# EAGLE design UMN_HASP_2015_Front_End_Board1 (EAGLE 6.5.0)

## Sheet 1 of 5: Channel 1
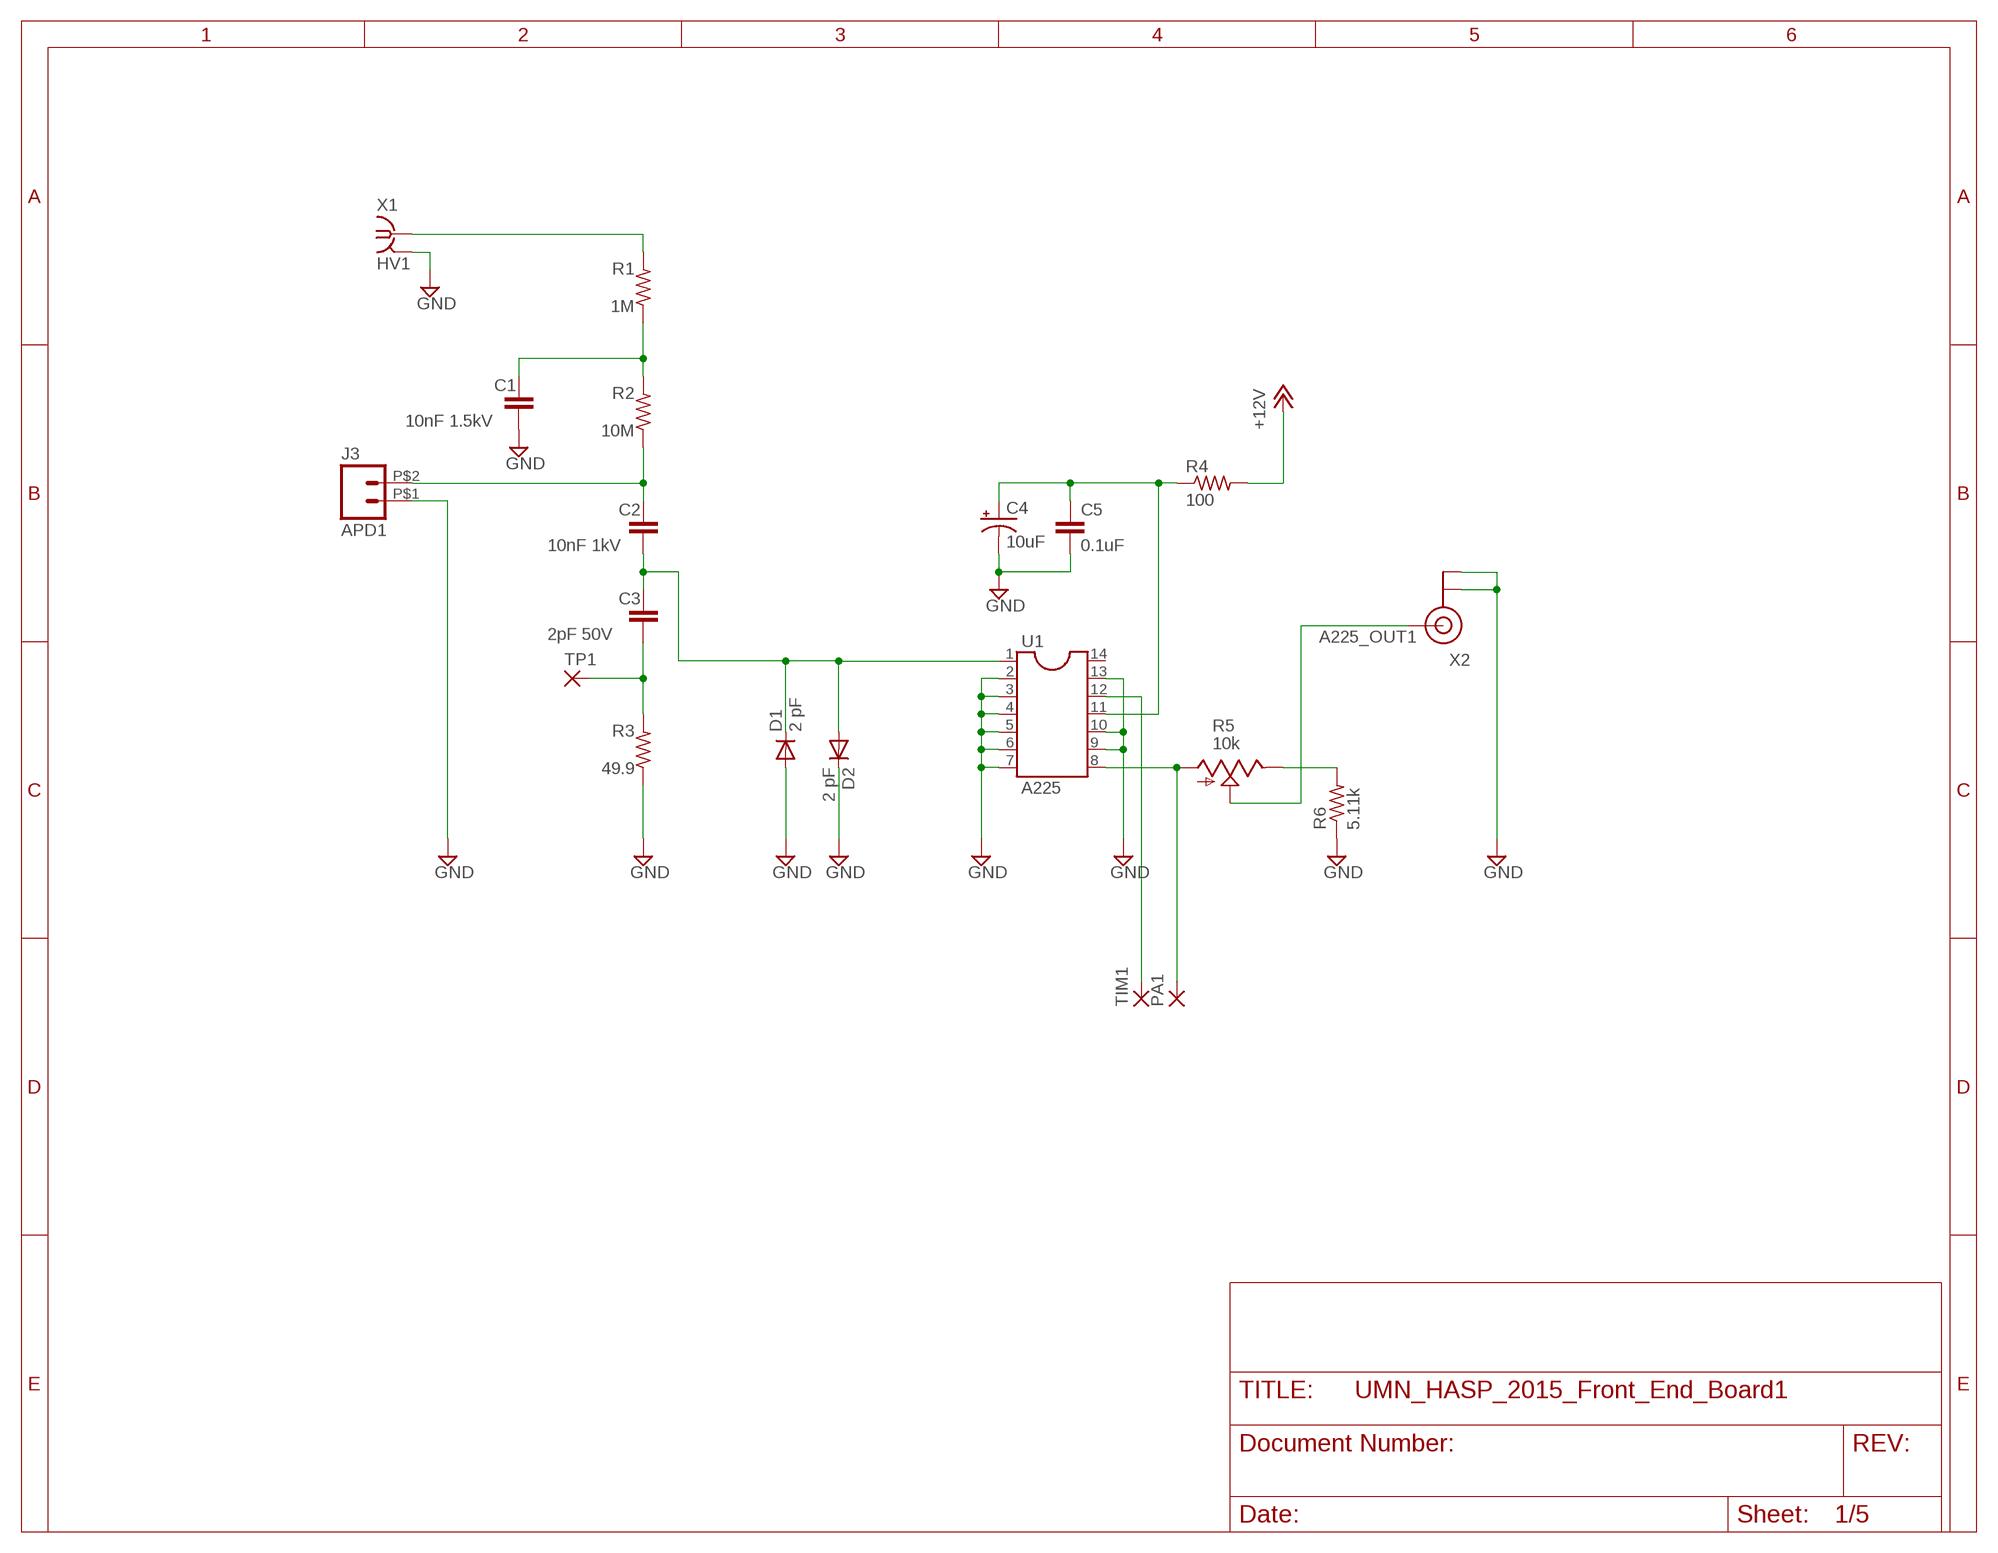
[diagram p0: schematic, sheet 1]

### Parts
C1  10nF 1.5kV  C-EUC1206K  [C1206K]
C2  10nF 1kV  C-EU050-050X075  [C050-050X075]
C3  2pF 50V  C-EUC0402  [C0402]
C4  10uF  CPOL-USC/6032-28R  [C/6032-28R]
C5  0.1uF  C-EUC0603K  [C0603K]
D1  2 pF  DIODE-SOD323-R  [SOD323-R]
D2  2 pF  DIODE-SOD323-R  [SOD323-R]
J3  M02PTH2  [1X02_BIG]
PA1  WIREPADSMD1,27-254  [SMD1,27-2,54]
R1  1M  R-US_R1206  [R1206]
R2  10M  R-US_R1206  [R1206]
R3  49.9  R-US_R0603  [R0603]
R4  100  R-US_R0603  [R0603]
R5  10k  TRIM_US-3223J  [3223J]
R6  5.11k  R-US_R0603  [R0603]
TIM1  WIREPADSMD1,27-254  [SMD1,27-2,54]
TP1  WIREPADSMD1,27-254  [SMD1,27-2,54]
U1  A225  DIL14S  [SOCKET-14]
X1  HV1  BU-SMA-V  [BU-SMA-V]
X2  U.FL  [U.FL]

### Nets
+12V: R4.2 ; also sheet 2,3,4,5
A225_OUT1: R5.2(S) X2.P$3(SIGNAL)
APD1: C2.1 J3.P$2 R2.1
GND: C1.2 C4.- C5.2 D1.A D2.C J3.P$1 R3.1 R6.1 U1.2 U1.3 U1.4 U1.5 U1.6 U1.7 U1.9 U1.10 U1.13 X1.2(GND) X2.P$1(GND) X2.P$2(GND) ; also sheet 2,3,4,5
HV1: R1.2 X1.1
N$1: C1.1 R1.1 R2.2
N$5: C2.2 C3.1 D1.C D2.A U1.1
N$6: R5.3(E) R6.2
N$7: C4.+ C5.1 R4.1 U1.11
PREAMPOUT1: PA1.1(P) R5.1(A) U1.8
TIMING1: TIM1.1(P) U1.12
TP1: C3.2 R3.2 TP1.1(P)
Unconnected: U1.14

## Sheet 2 of 5: Channel 2
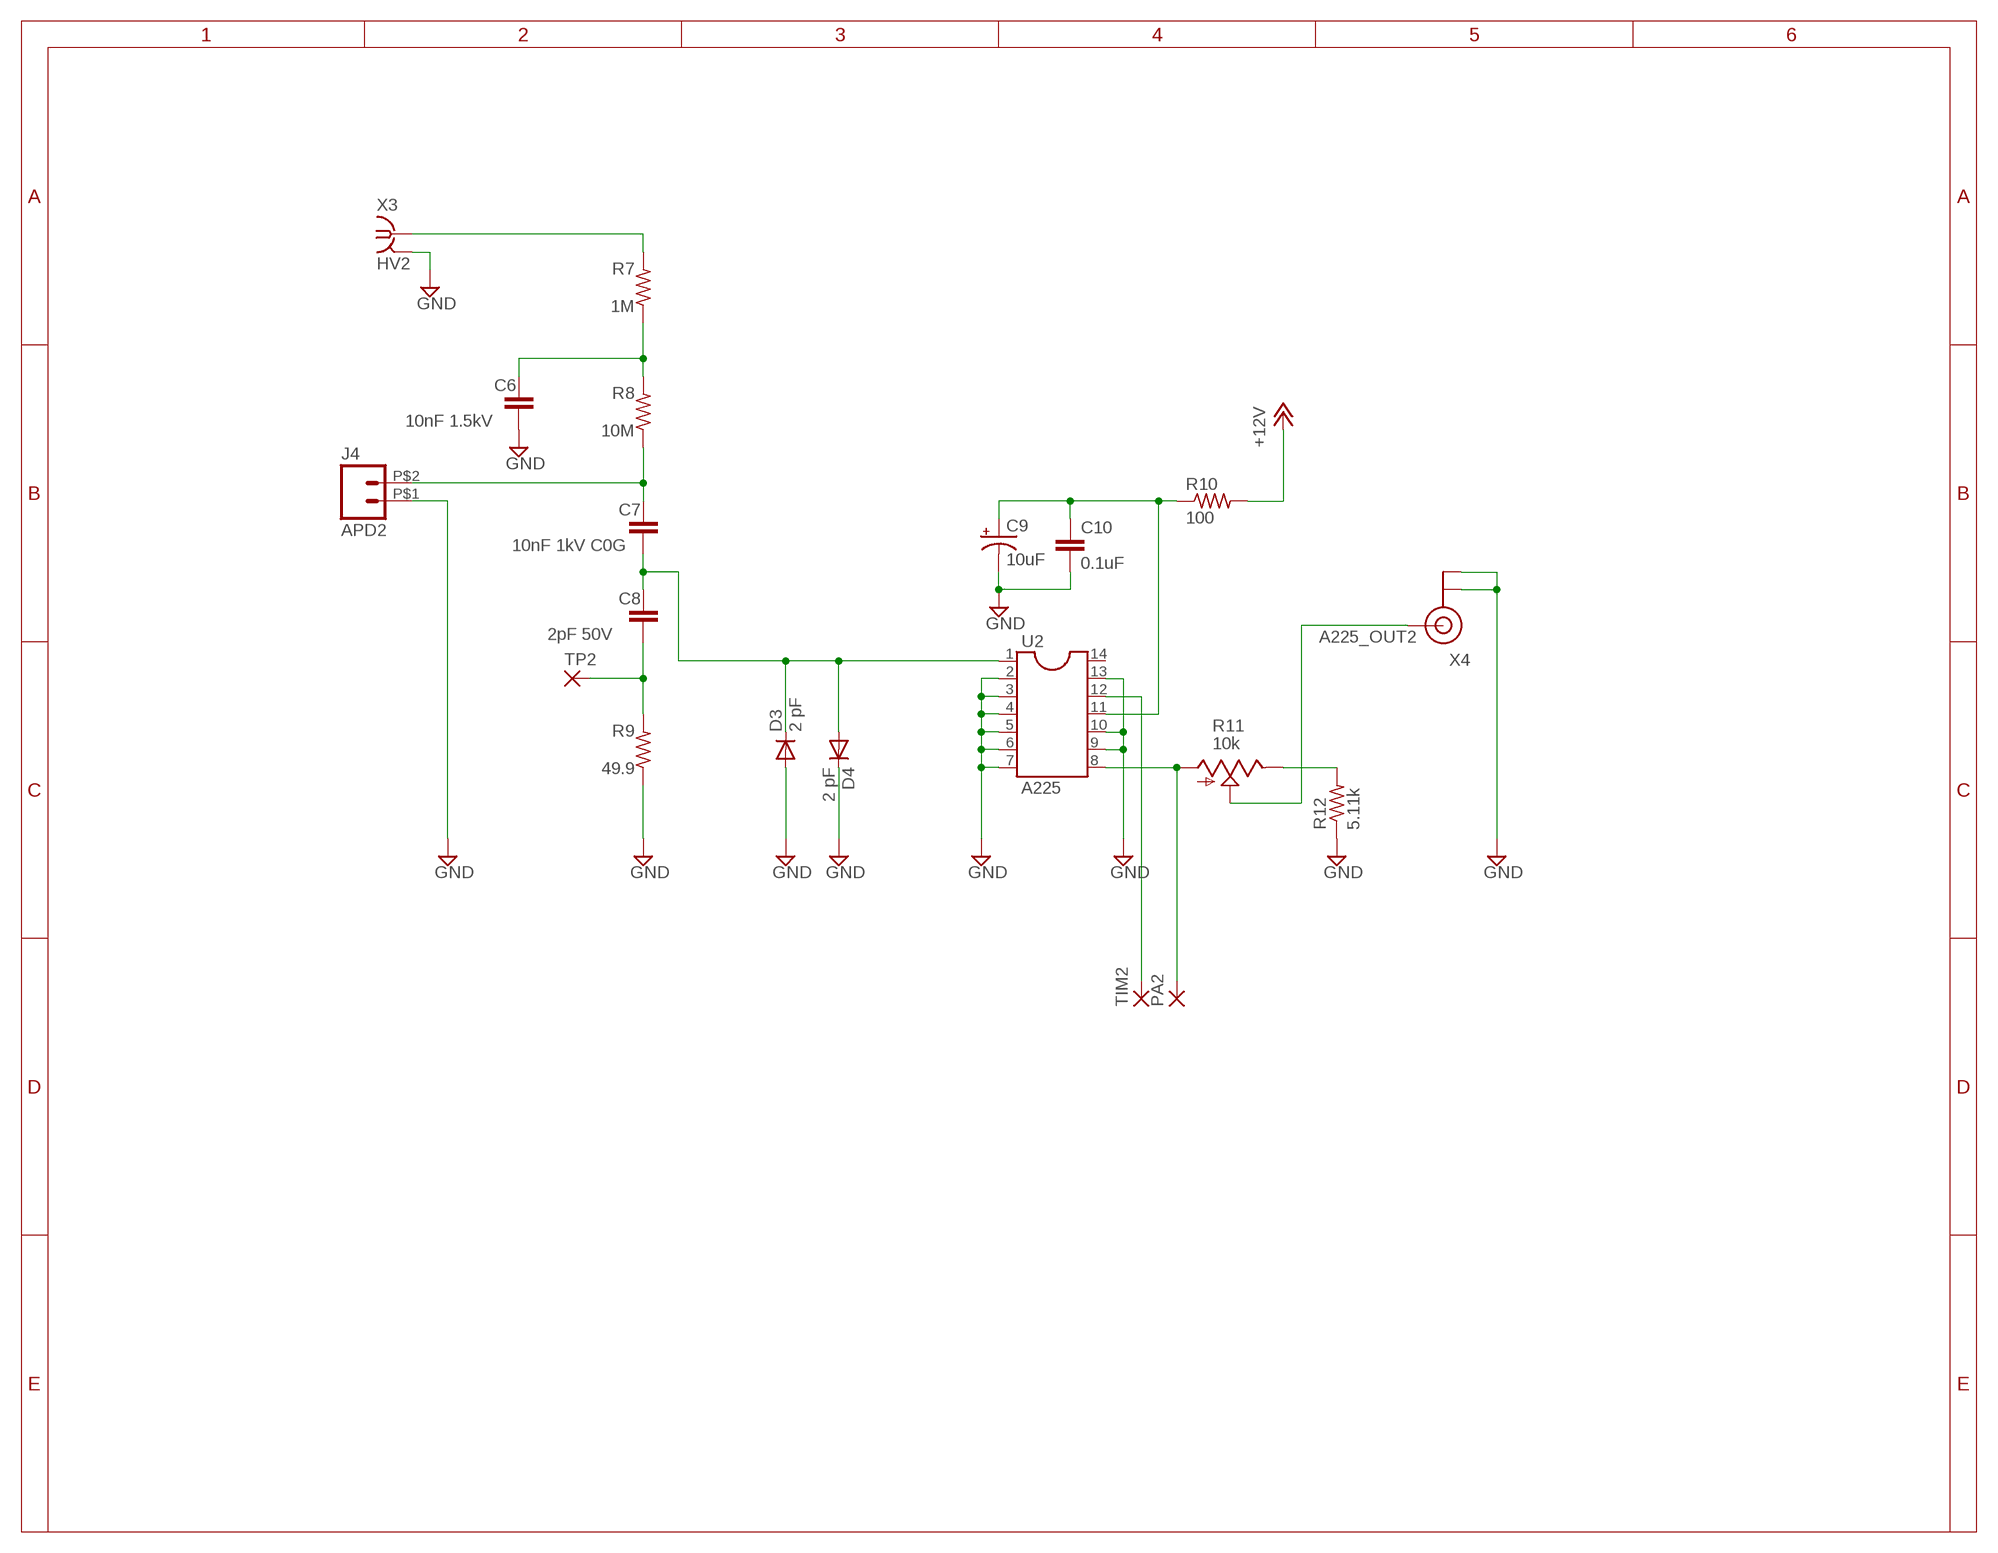
[diagram p1: schematic, sheet 2]

### Parts
C6  10nF 1.5kV  C-EUC1206K  [C1206K]
C7  10nF 1kV C0G  C-EU050-050X075  [C050-050X075]
C8  2pF 50V  C-EUC0402  [C0402]
C9  10uF  CPOL-USC/6032-28R  [C/6032-28R]
C10  0.1uF  C-EUC0603K  [C0603K]
D3  2 pF  DIODE-SOD323-R  [SOD323-R]
D4  2 pF  DIODE-SOD323-R  [SOD323-R]
J4  M02PTH2  [1X02_BIG]
PA2  WIREPADSMD1,27-254  [SMD1,27-2,54]
R7  1M  R-US_R1206  [R1206]
R8  10M  R-US_R1206  [R1206]
R9  49.9  R-US_R0603  [R0603]
R10  100  R-US_R0603  [R0603]
R11  10k  TRIM_US-3223J  [3223J]
R12  5.11k  R-US_R0603  [R0603]
TIM2  WIREPADSMD1,27-254  [SMD1,27-2,54]
TP2  WIREPADSMD1,27-254  [SMD1,27-2,54]
U2  A225  DIL14S  [SOCKET-14]
X3  HV2  BU-SMA-V  [BU-SMA-V]
X4  U.FL  [U.FL]

### Nets
+12V: R10.2 ; also sheet 1,3,4,5
A225_OUT2: R11.2(S) X4.P$3(SIGNAL)
APD2: C7.1 J4.P$2 R8.1
GND: C6.2 C9.- C10.2 D3.A D4.C J4.P$1 R9.1 R12.1 U2.2 U2.3 U2.4 U2.5 U2.6 U2.7 U2.9 U2.10 U2.13 X3.2(GND) X4.P$1(GND) X4.P$2(GND) ; also sheet 1,3,4,5
HV2: R7.2 X3.1
N$11: C9.+ C10.1 R10.1 U2.11
N$15: C6.1 R7.1 R8.2
N$17: C7.2 C8.1 D3.C D4.A U2.1
N$20: R11.3(E) R12.2
PREAMPOUT2: PA2.1(P) R11.1(A) U2.8
TIMING2: TIM2.1(P) U2.12
TP2: C8.2 R9.2 TP2.1(P)
Unconnected: U2.14

## Sheet 3 of 5: Channel 3
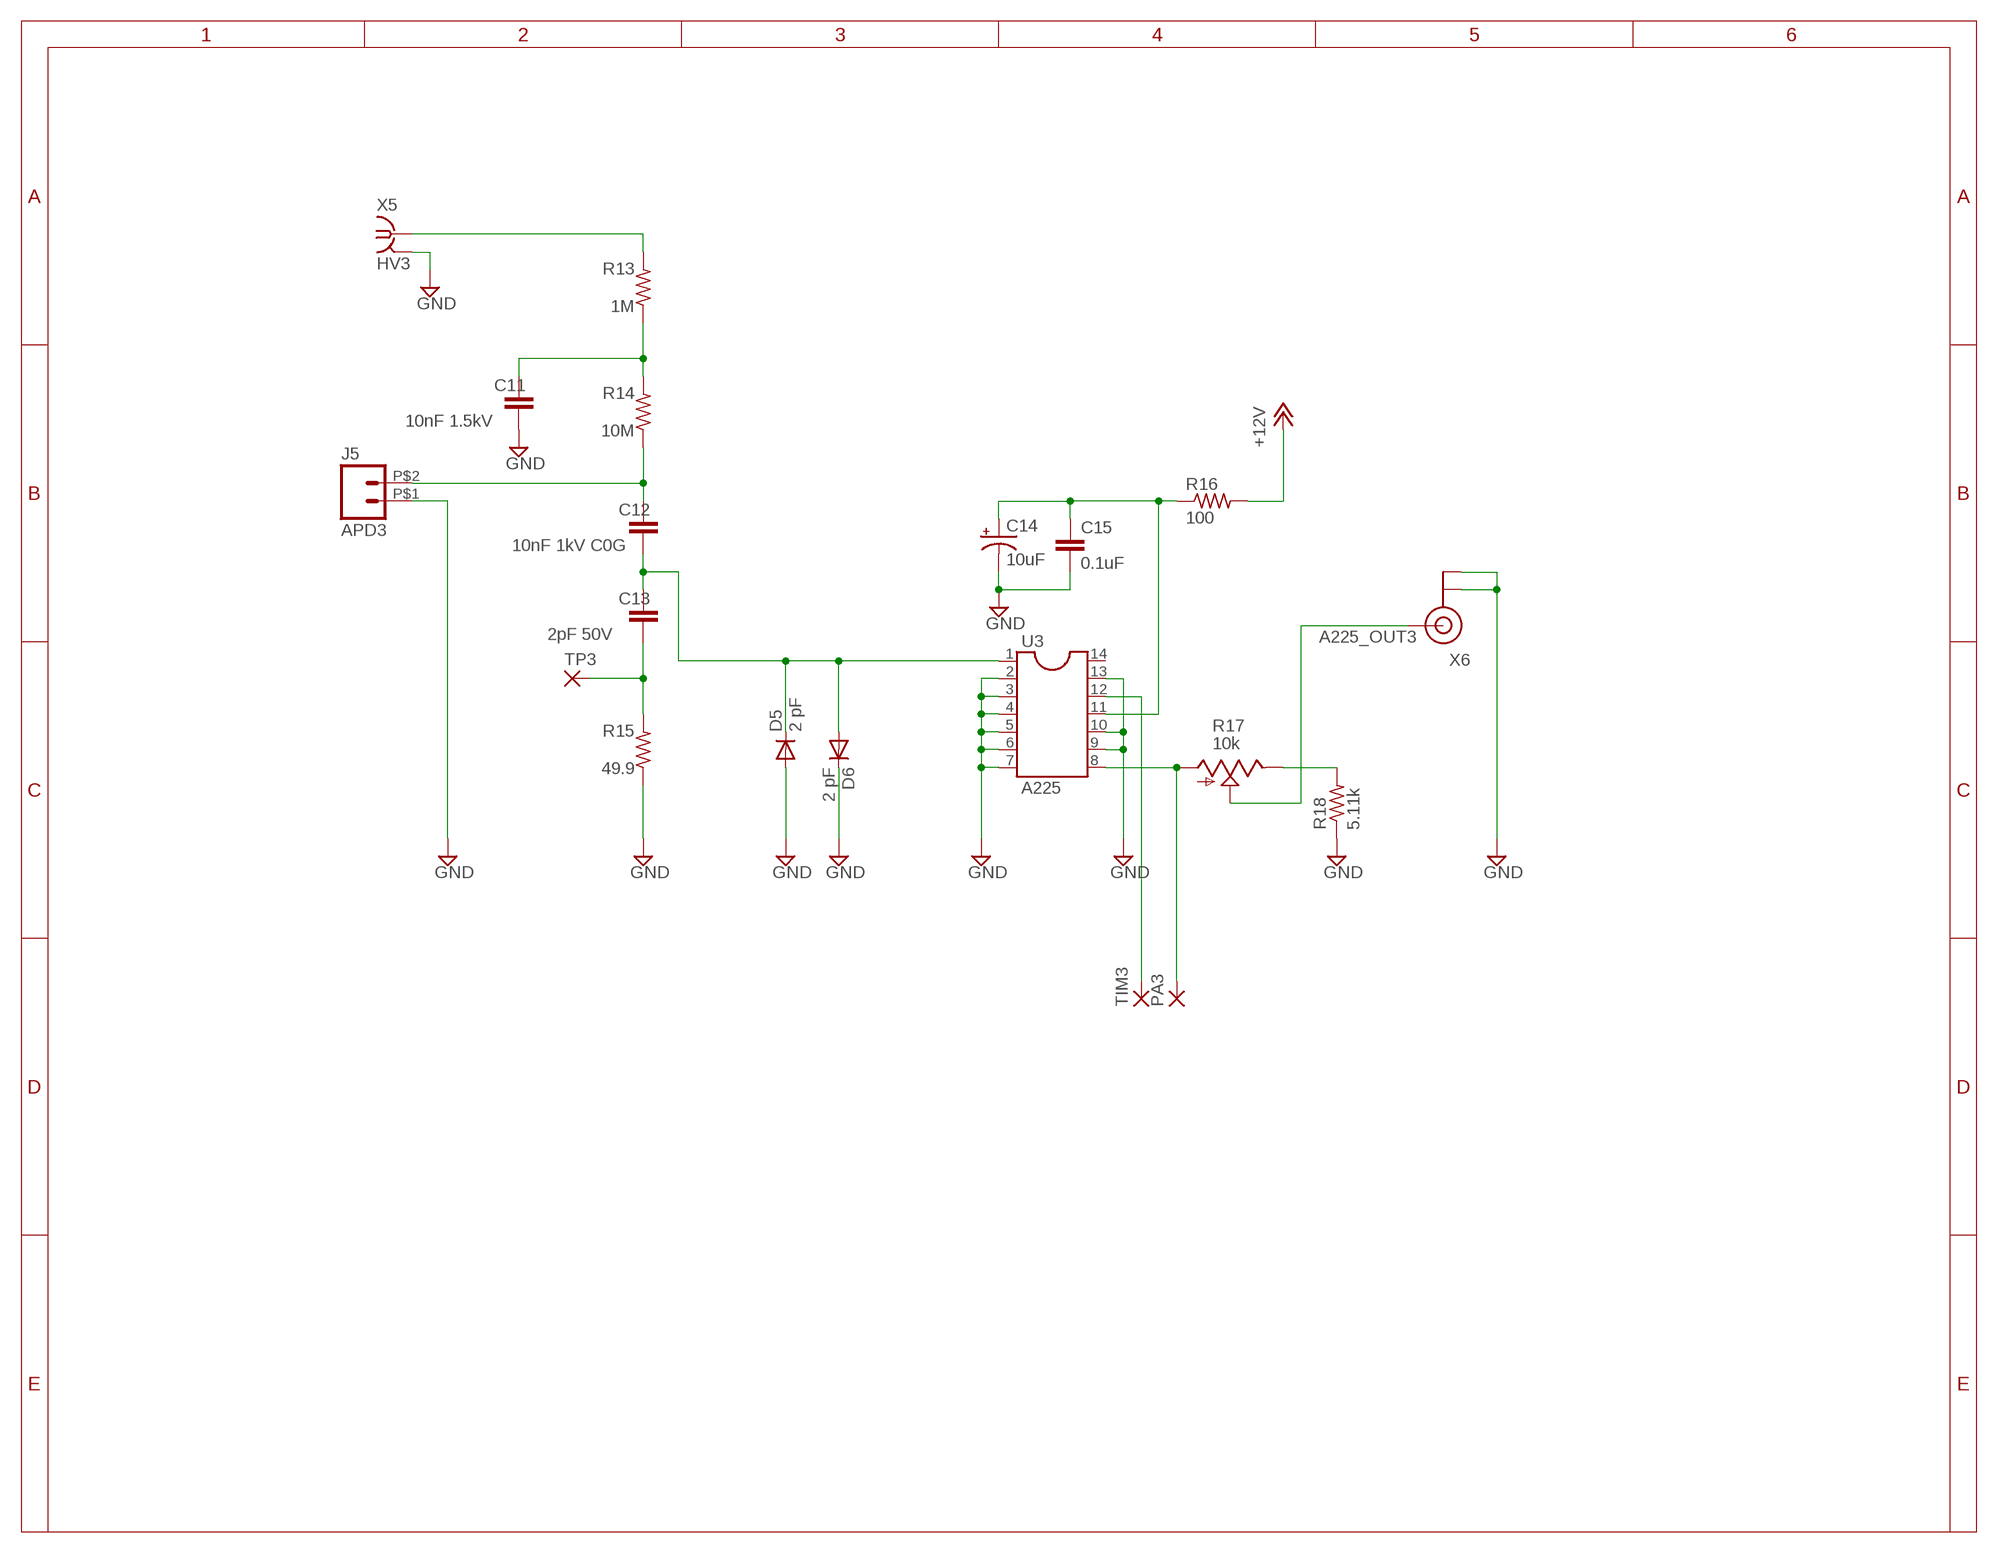
[diagram p2: schematic, sheet 3]

### Parts
C11  10nF 1.5kV  C-EUC1206K  [C1206K]
C12  10nF 1kV C0G  C-EU050-050X075  [C050-050X075]
C13  2pF 50V  C-EUC0402  [C0402]
C14  10uF  CPOL-USC/6032-28R  [C/6032-28R]
C15  0.1uF  C-EUC0603K  [C0603K]
D5  2 pF  DIODE-SOD323-R  [SOD323-R]
D6  2 pF  DIODE-SOD323-R  [SOD323-R]
J5  M02PTH2  [1X02_BIG]
PA3  WIREPADSMD1,27-254  [SMD1,27-2,54]
R13  1M  R-US_R1206  [R1206]
R14  10M  R-US_R1206  [R1206]
R15  49.9  R-US_R0603  [R0603]
R16  100  R-US_R0603  [R0603]
R17  10k  TRIM_US-3223J  [3223J]
R18  5.11k  R-US_R0603  [R0603]
TIM3  WIREPADSMD1,27-254  [SMD1,27-2,54]
TP3  WIREPADSMD1,27-254  [SMD1,27-2,54]
U3  A225  DIL14S  [SOCKET-14]
X5  HV3  BU-SMA-V  [BU-SMA-V]
X6  U.FL  [U.FL]

### Nets
+12V: R16.2 ; also sheet 1,2,4,5
A225_OUT3: R17.2(S) X6.P$3(SIGNAL)
APD3: C12.1 J5.P$2 R14.1
GND: C11.2 C14.- C15.2 D5.A D6.C J5.P$1 R15.1 R18.1 U3.2 U3.3 U3.4 U3.5 U3.6 U3.7 U3.9 U3.10 U3.13 X5.2(GND) X6.P$1(GND) X6.P$2(GND) ; also sheet 1,2,4,5
HV3: R13.2 X5.1
N$2: C11.1 R13.1 R14.2
N$3: C12.2 C13.1 D5.C D6.A U3.1
N$4: R17.3(E) R18.2
N$9: C14.+ C15.1 R16.1 U3.11
PREAMPOUT3: PA3.1(P) R17.1(A) U3.8
TIMING3: TIM3.1(P) U3.12
TP3: C13.2 R15.2 TP3.1(P)
Unconnected: U3.14

## Sheet 4 of 5: Channel 4
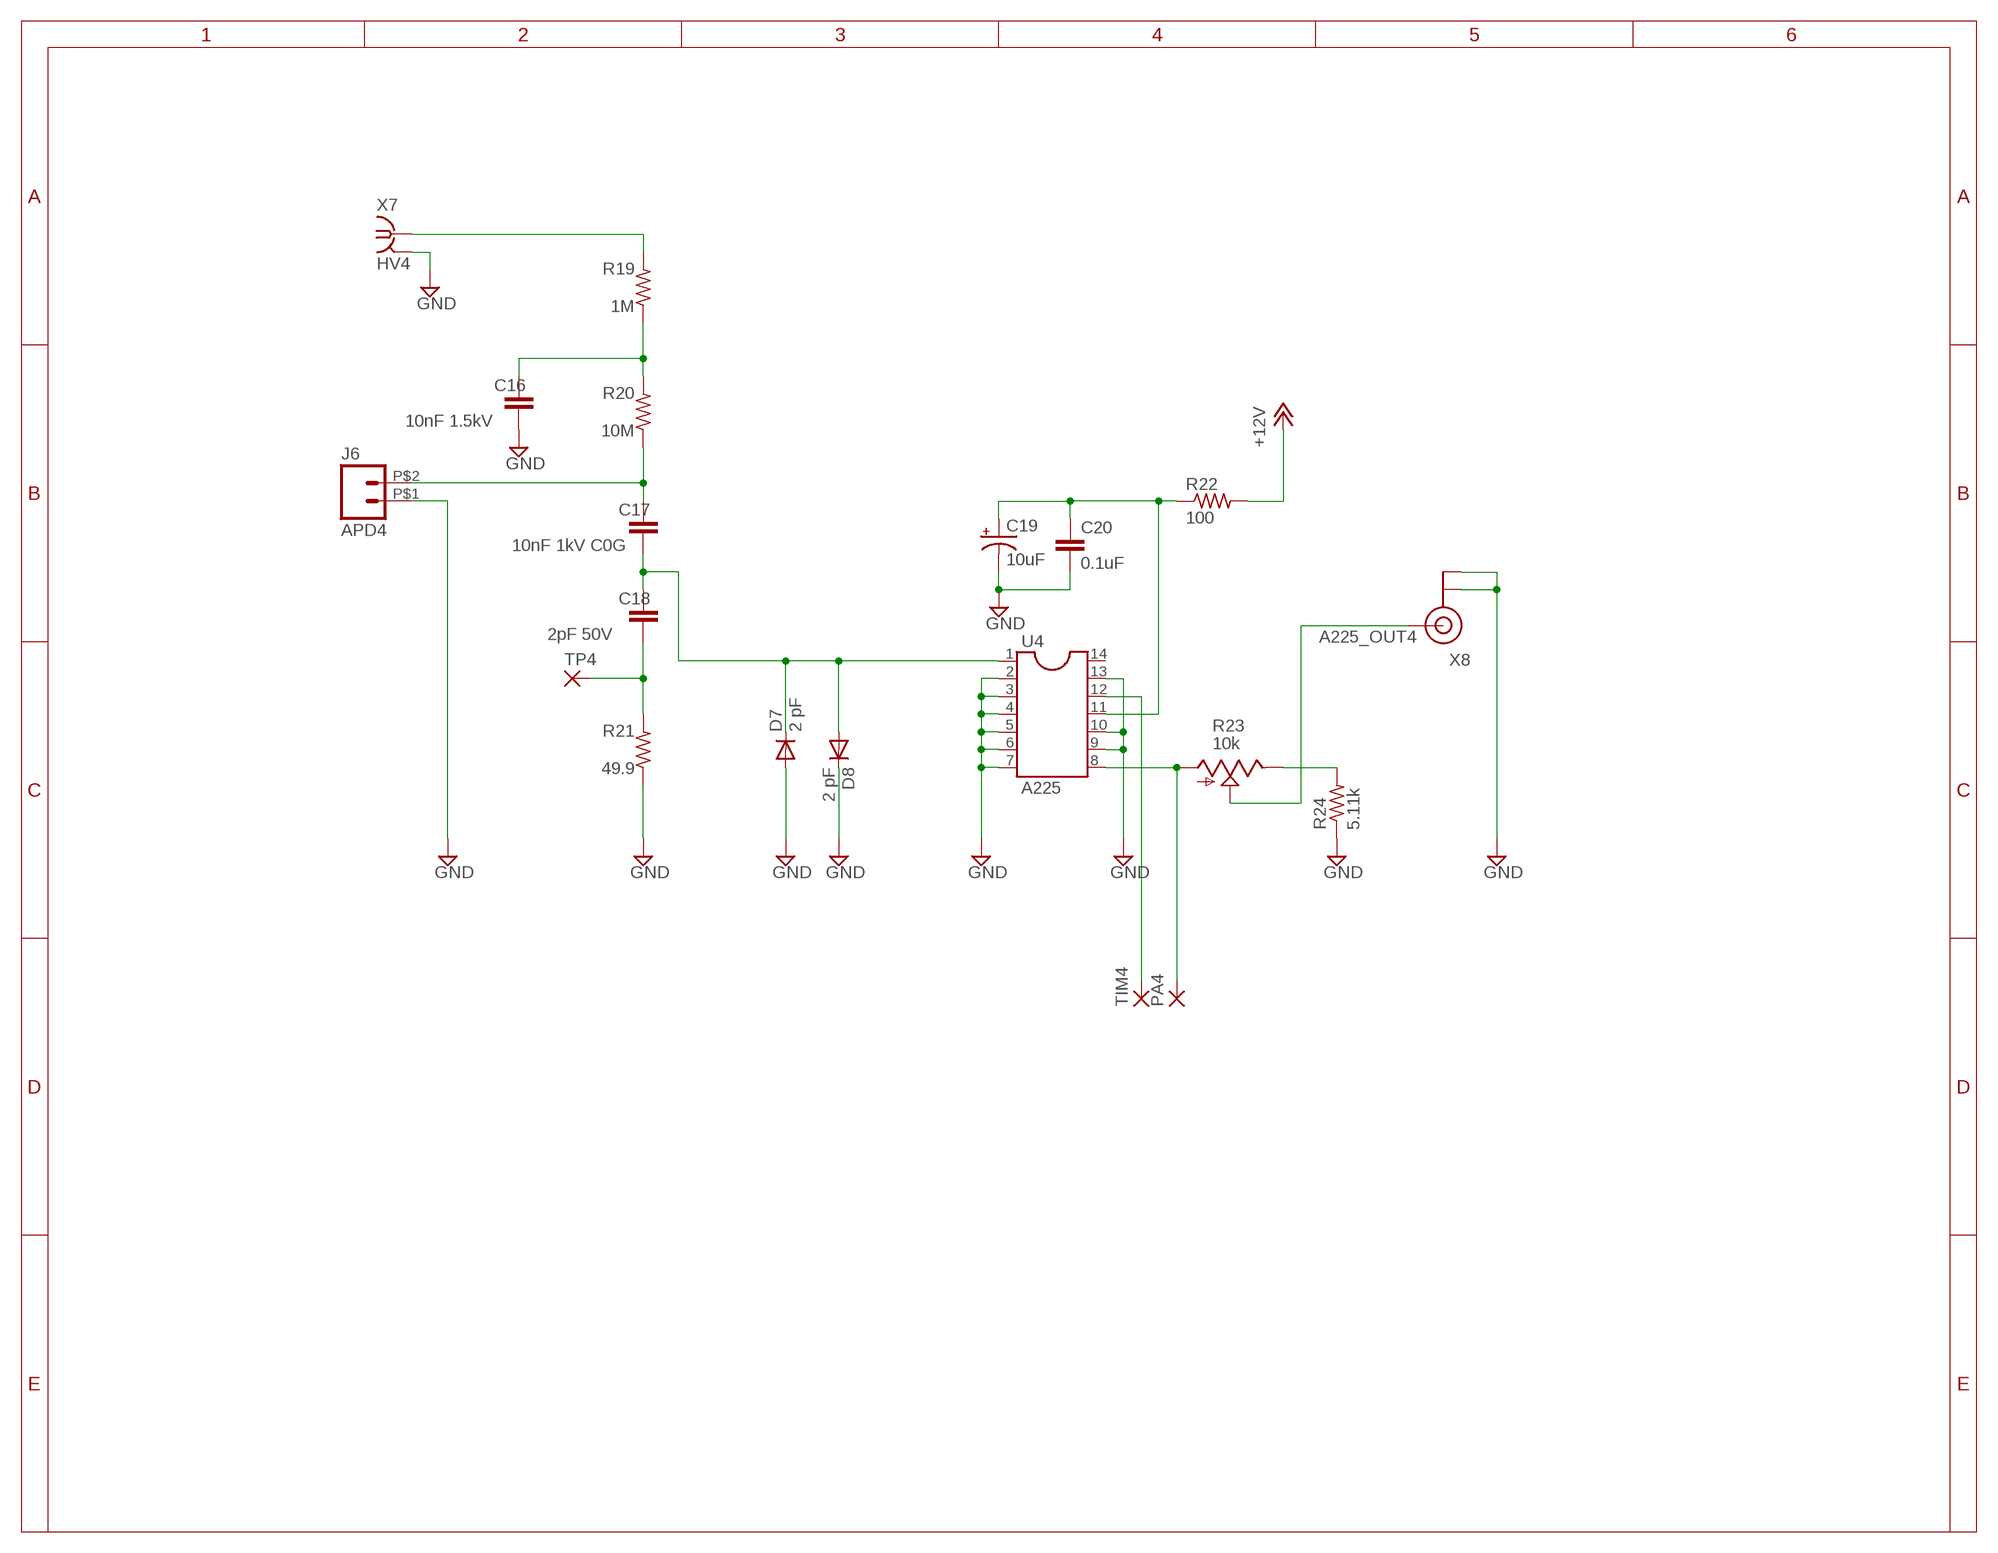
[diagram p3: schematic, sheet 4]

### Parts
C16  10nF 1.5kV  C-EUC1206K  [C1206K]
C17  10nF 1kV C0G  C-EU050-050X075  [C050-050X075]
C18  2pF 50V  C-EUC0402  [C0402]
C19  10uF  CPOL-USC/6032-28R  [C/6032-28R]
C20  0.1uF  C-EUC0603K  [C0603K]
D7  2 pF  DIODE-SOD323-R  [SOD323-R]
D8  2 pF  DIODE-SOD323-R  [SOD323-R]
J6  M02PTH2  [1X02_BIG]
PA4  WIREPADSMD1,27-254  [SMD1,27-2,54]
R19  1M  R-US_R1206  [R1206]
R20  10M  R-US_R1206  [R1206]
R21  49.9  R-US_R0603  [R0603]
R22  100  R-US_R0603  [R0603]
R23  10k  TRIM_US-3223J  [3223J]
R24  5.11k  R-US_R0603  [R0603]
TIM4  WIREPADSMD1,27-254  [SMD1,27-2,54]
TP4  WIREPADSMD1,27-254  [SMD1,27-2,54]
U4  A225  DIL14S  [SOCKET-14]
X7  HV4  BU-SMA-V  [BU-SMA-V]
X8  U.FL  [U.FL]

### Nets
+12V: R22.2 ; also sheet 1,2,3,5
A225_OUT4: R23.2(S) X8.P$3(SIGNAL)
APD4: C17.1 J6.P$2 R20.1
GND: C16.2 C19.- C20.2 D7.A D8.C J6.P$1 R21.1 R24.1 U4.2 U4.3 U4.4 U4.5 U4.6 U4.7 U4.9 U4.10 U4.13 X7.2(GND) X8.P$1(GND) X8.P$2(GND) ; also sheet 1,2,3,5
HV4: R19.2 X7.1
N$8: C19.+ C20.1 R22.1 U4.11
N$19: C16.1 R19.1 R20.2
N$22: C17.2 C18.1 D7.C D8.A U4.1
N$24: R23.3(E) R24.2
PREAMPOUT4: PA4.1(P) R23.1(A) U4.8
TIMING4: TIM4.1(P) U4.12
TP4: C18.2 R21.2 TP4.1(P)
Unconnected: U4.14

## Sheet 5 of 5: PC/104
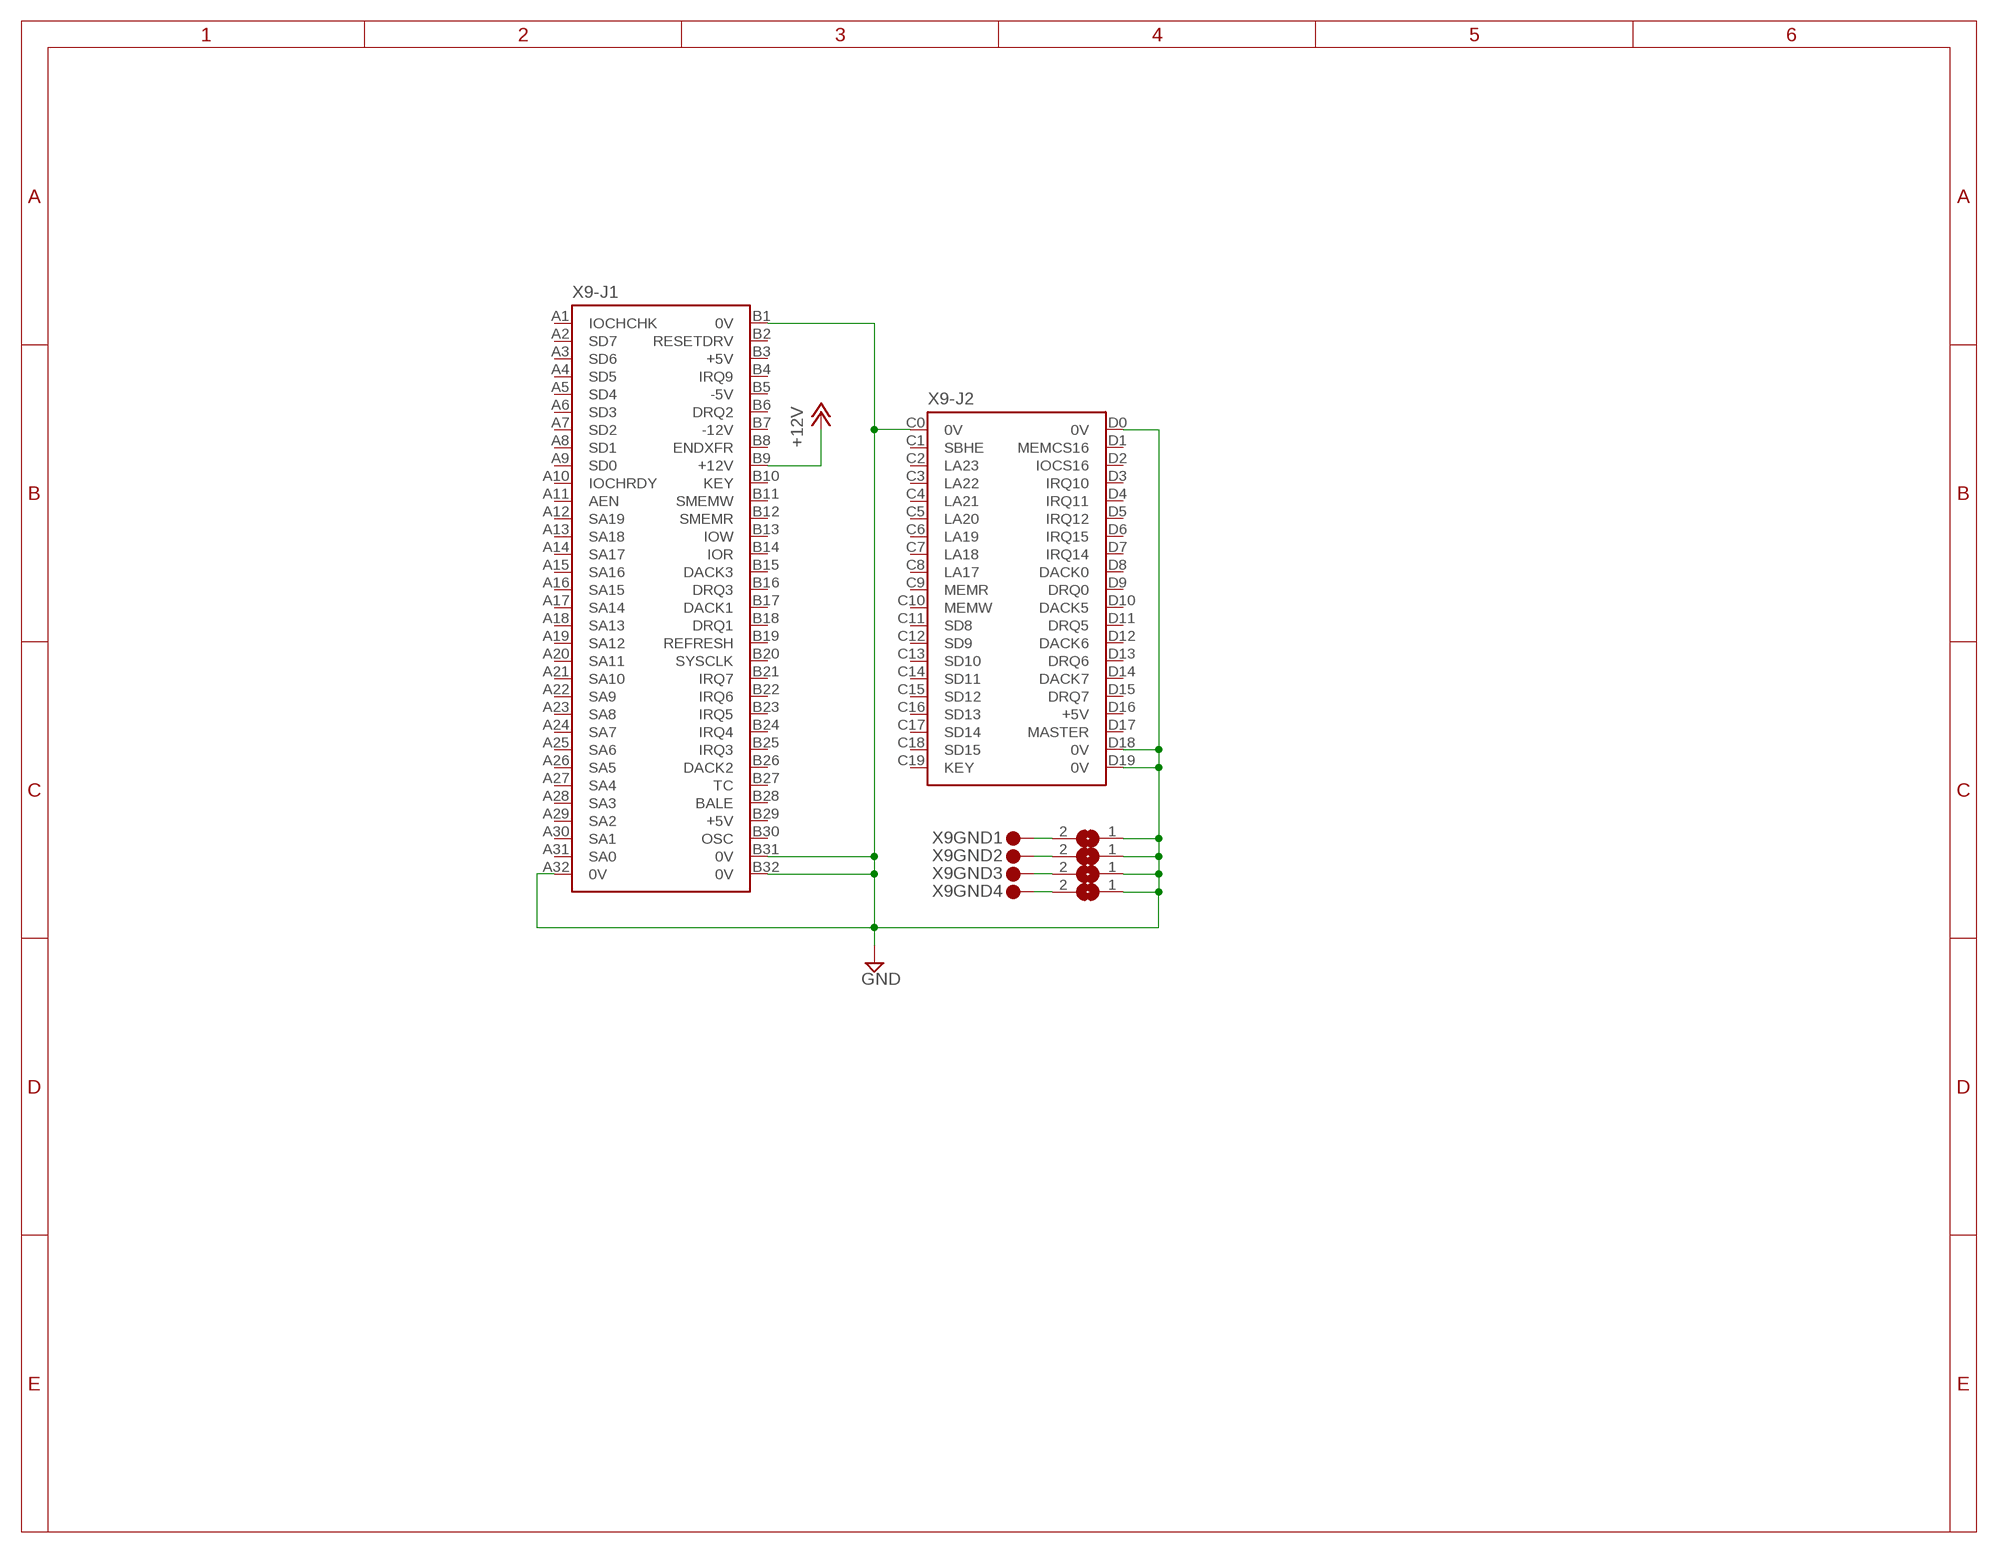
[diagram p4: schematic, sheet 5]

### Parts
SJ1  SJ  [SJ]
SJ2  SJ  [SJ]
SJ3  SJ  [SJ]
SJ4  SJ  [SJ]
X9  PC104_STANDARD1  [PC104-STANDARD]

### Nets
+12V: X9.B9(-J1:+12V) ; also sheet 1,2,3,4
GND: SJ1.1 SJ2.1 SJ3.1 SJ4.1 X9.A32(-J1:0V) X9.B1(-J1:0V) X9.B31(-J1:0V) X9.B32(-J1:0V) X9.C0(-J2:0V) X9.D0(-J2:0V) X9.D18(-J2:0V) X9.D19(-J2:0V) ; also sheet 1,2,3,4
N$10: SJ4.2 X9.GND@4
N$12: SJ3.2 X9.GND@3
N$13: SJ2.2 X9.GND@2
N$14: SJ1.2 X9.GND@1
Unconnected: X9.A1(-J1:IOCHCHK) X9.A2(-J1:SD7) X9.A3(-J1:SD6) X9.A4(-J1:SD5) X9.A5(-J1:SD4) X9.A6(-J1:SD3) X9.A7(-J1:SD2) X9.A8(-J1:SD1) X9.A9(-J1:SD0) X9.A10(-J1:IOCHRDY) X9.A11(-J1:AEN) X9.A12(-J1:SA19) X9.A13(-J1:SA18) X9.A14(-J1:SA17) X9.A15(-J1:SA16) X9.A16(-J1:SA15) X9.A17(-J1:SA14) X9.A18(-J1:SA13) X9.A19(-J1:SA12) X9.A20(-J1:SA11) X9.A21(-J1:SA10) X9.A22(-J1:SA9) X9.A23(-J1:SA8) X9.A24(-J1:SA7) X9.A25(-J1:SA6) X9.A26(-J1:SA5) X9.A27(-J1:SA4) X9.A28(-J1:SA3) X9.A29(-J1:SA2) X9.A30(-J1:SA1) X9.A31(-J1:SA0) X9.B2(-J1:RESETDRV) X9.B3(-J1:+5V) X9.B4(-J1:IRQ9) X9.B5(-J1:-5V) X9.B6(-J1:DRQ2) X9.B7(-J1:-12V) X9.B8(-J1:ENDXFR) X9.B10(-J1:KEY) X9.B11(-J1:SMEMW) X9.B12(-J1:SMEMR) X9.B13(-J1:IOW) X9.B14(-J1:IOR) X9.B15(-J1:DACK3) X9.B16(-J1:DRQ3) X9.B17(-J1:DACK1) X9.B18(-J1:DRQ1) X9.B19(-J1:REFRESH) X9.B20(-J1:SYSCLK) X9.B21(-J1:IRQ7) X9.B22(-J1:IRQ6) X9.B23(-J1:IRQ5) X9.B24(-J1:IRQ4) X9.B25(-J1:IRQ3) X9.B26(-J1:DACK2) X9.B27(-J1:TC) X9.B28(-J1:BALE) X9.B29(-J1:+5V) X9.B30(-J1:OSC) X9.C1(-J2:SBHE) X9.C2(-J2:LA23) X9.C3(-J2:LA22) X9.C4(-J2:LA21) X9.C5(-J2:LA20) X9.C6(-J2:LA19) X9.C7(-J2:LA18) X9.C8(-J2:LA17) X9.C9(-J2:MEMR) X9.C10(-J2:MEMW) X9.C11(-J2:SD8) X9.C12(-J2:SD9) X9.C13(-J2:SD10) X9.C14(-J2:SD11) X9.C15(-J2:SD12) X9.C16(-J2:SD13) X9.C17(-J2:SD14) X9.C18(-J2:SD15) X9.C19(-J2:KEY) X9.D1(-J2:MEMCS16) X9.D2(-J2:IOCS16) X9.D3(-J2:IRQ10) X9.D4(-J2:IRQ11) X9.D5(-J2:IRQ12) X9.D6(-J2:IRQ15) X9.D7(-J2:IRQ14) X9.D8(-J2:DACK0) X9.D9(-J2:DRQ0) X9.D10(-J2:DACK5) X9.D11(-J2:DRQ5) X9.D12(-J2:DACK6) X9.D13(-J2:DRQ6) X9.D14(-J2:DACK7) X9.D15(-J2:DRQ7) X9.D16(-J2:+5V) X9.D17(-J2:MASTER)

## Power pins joined to a net without a drawn wire
GND: X1.3(GND) X1.4(GND) X1.5(GND) X3.3(GND) X3.4(GND) X3.5(GND) X5.3(GND) X5.4(GND) X5.5(GND) X7.3(GND) X7.4(GND) X7.5(GND)

## Library data of the parts
C1-C3 C5-C8 C10-C13 C15-C18 C20 = resistor:C-EU: CAPACITOR, European symbol
C4 C9 C14 C19 = resistor:CPOL-US: POLARIZED CAPACITOR, American symbol
D1-D8 = diode:DIODE-: DIODE
J3-J6 = SparkFun-Connectors:M02: Standard 2-pin 0.1" header. Use with - straight break away headers ( PRT-00116) - right angle break away headers (PRT-00553) - swiss pins (PRT-00743) - machine pins (PRT-00117) - female headers (PRT-00115) Molex polarized connector foot print use with: PRT-08233 with associated crimp pins and housings. 2.54_SCREWTERM for use with PRT-10571. 3.5mm Screw Terminal footprints for PRT-08084 5mm Screw Terminal footprints for use with PRT-08433
PA1-PA4 TIM1-TIM4 TP1-TP4 = wirepad:WIREPAD: Wire PAD connect wire on PCB
R1-R4 R6-R10 R12-R16 R18-R22 R24 = resistor:R-US_: RESISTOR, American symbol
R5 R11 R17 R23 = pot:TRIM_US-: POTENTIOMETER
SJ1-SJ4 = jumper:SJ: SMD solder JUMPER
U1-U4 = ic-package:DIL14: Dual In Line / Socket
X1 X3 X5 X7 = con-coax:BU-SMA-V: FEMALE SMA CONNECTOR Radiall distributor RS 112-3794
X2 X4 X6 X8 = SparkFun-Connectors:U.FL: SMD antenna connector- WRL-09144; PROD_ID: CONN-09193
X9 = con-pc104:PC104_STANDARD: PC/104 Standard 16 bit

## Board
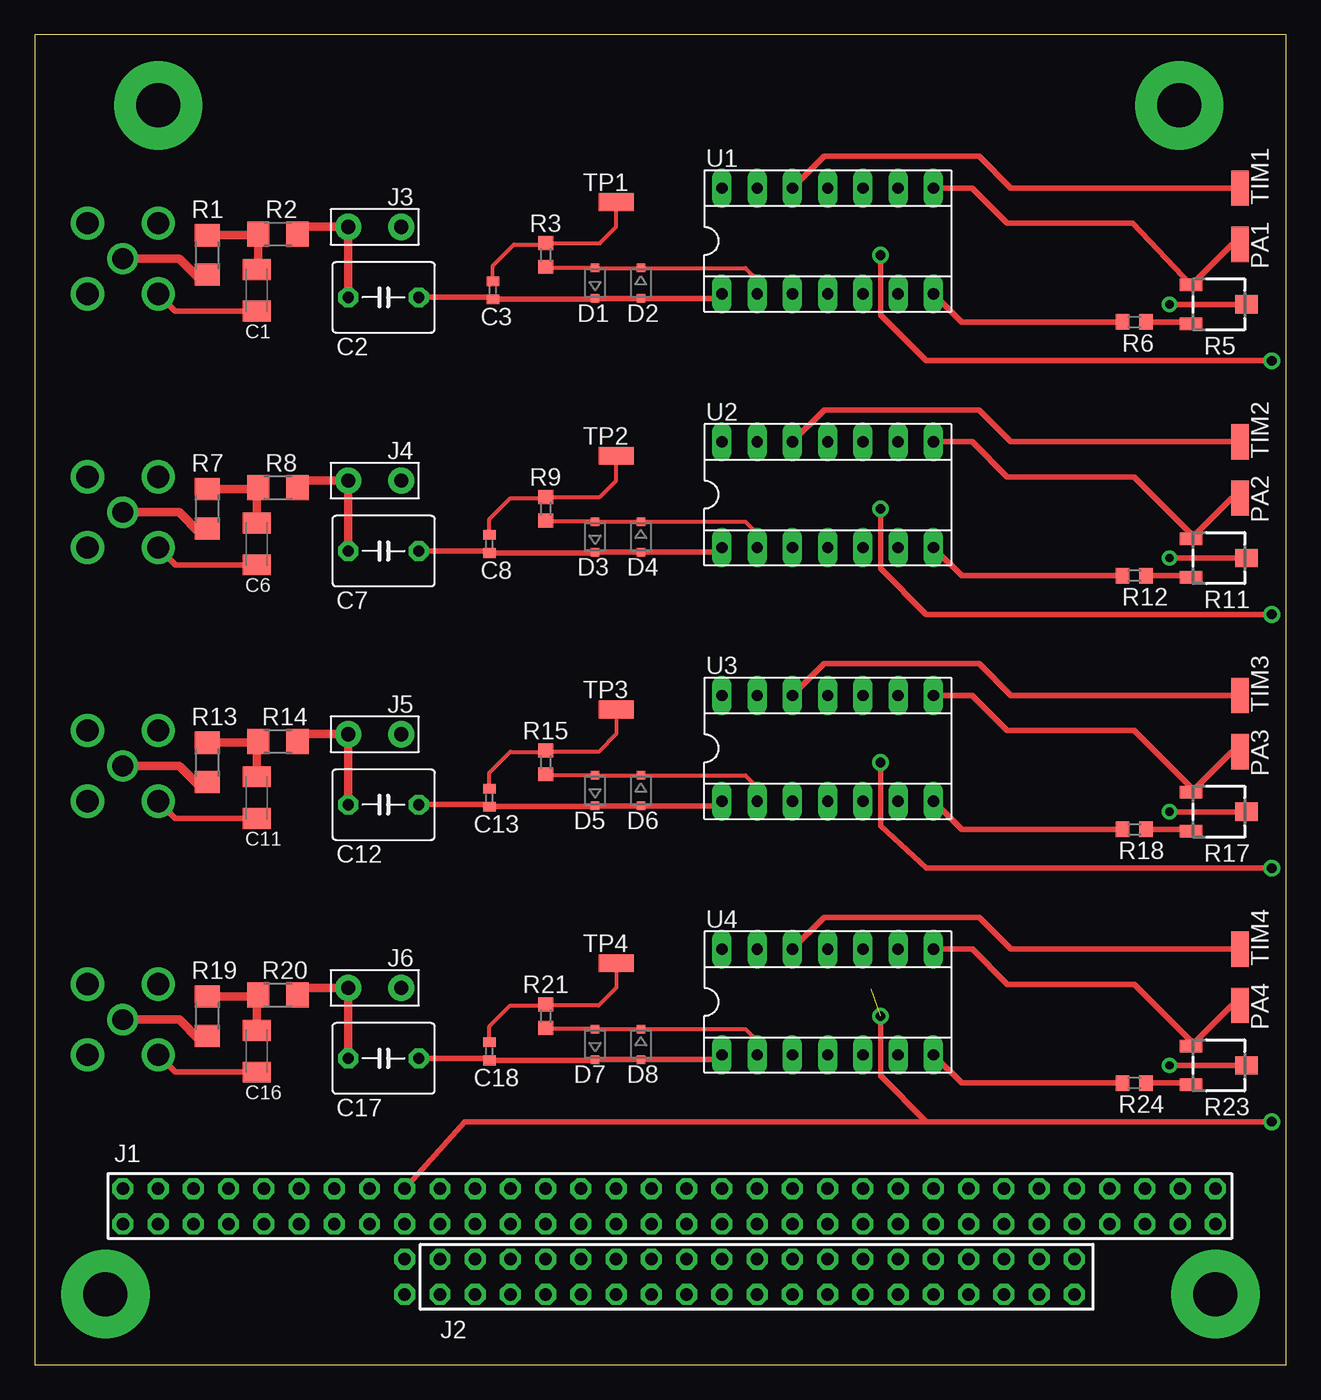
[diagram p5: board, top side]
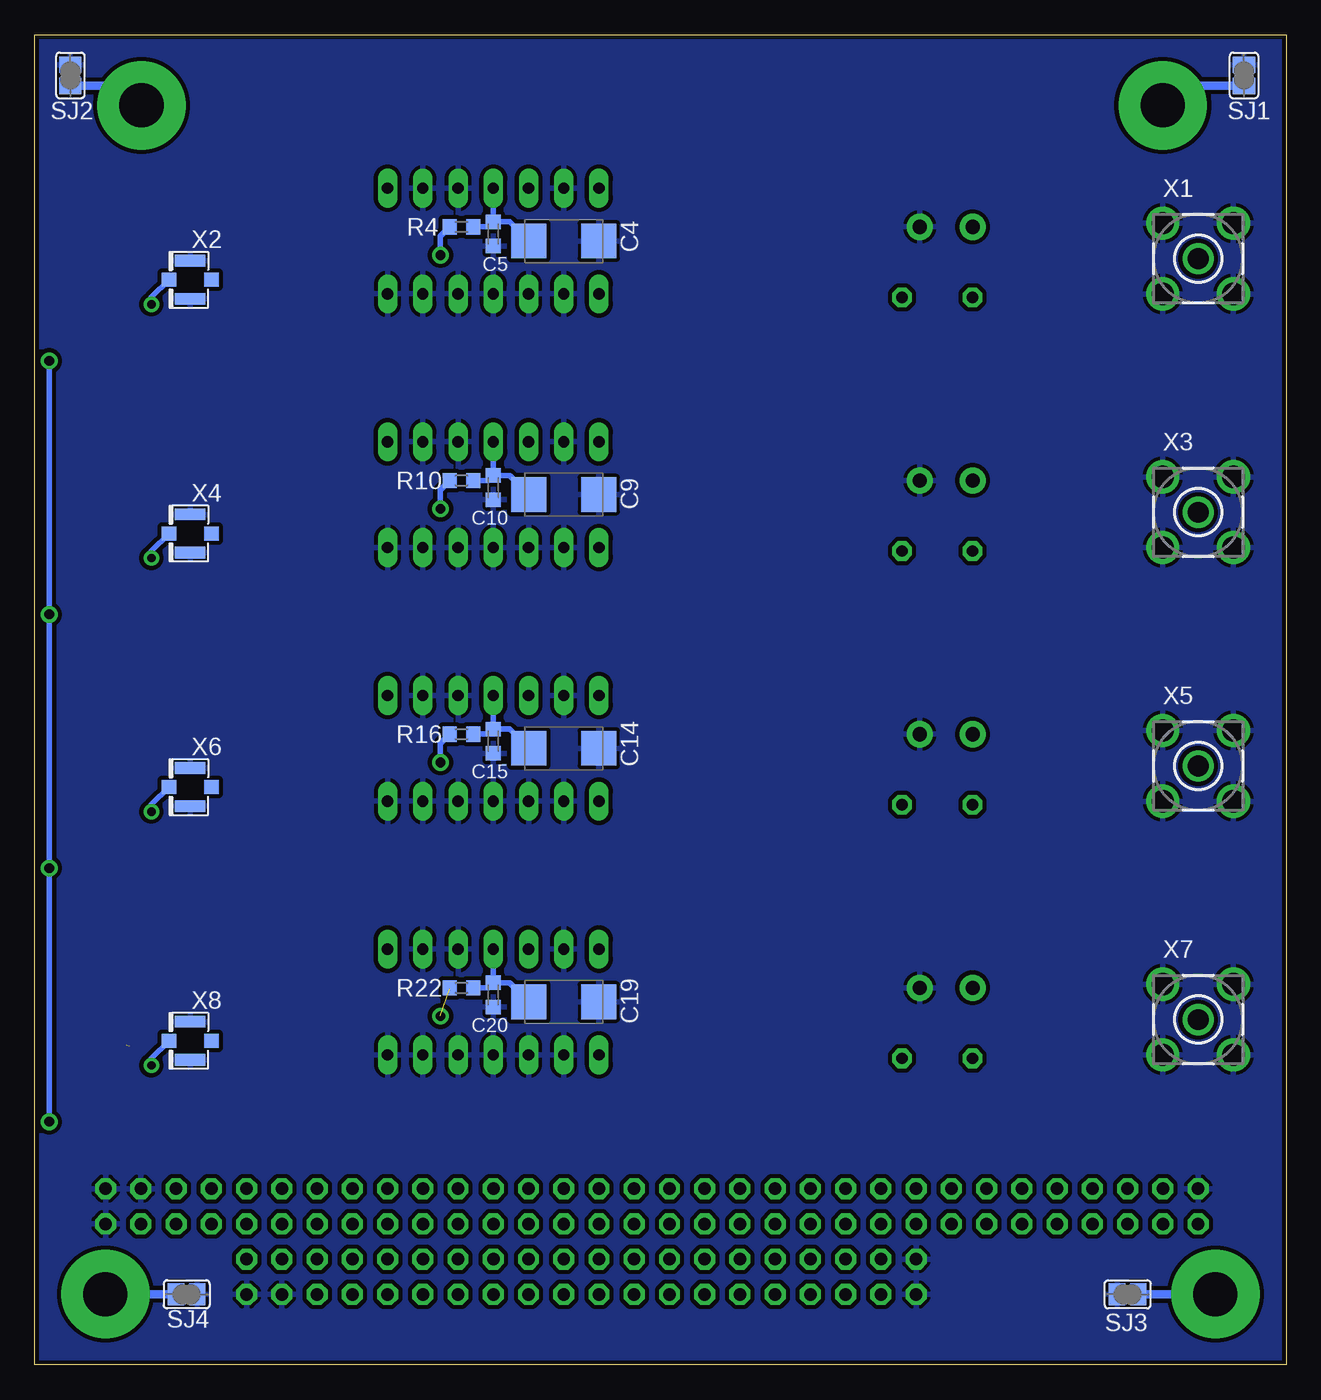
[diagram p6: board, bottom side, seen from below]

Size 90.2 x 95.9 mm. Coordinates in mm from the lower left corner, seen from the top.
Copper layers (1*16): Top 0.035mm / dielectric 1.5mm / Bottom 0.035mm
Design rules "AdvancedCircuits": minimum track width 8mil, minimum drill 15mil, track to track 8mil, track to pad 8mil, pad to pad 8mil, via to via 8mil, smd to smd 8mil, copper to edge 10mil, drill to drill 8mil, minimum pad ring 12mil, minimum via ring 10mil, stop-mask expansion 4mil, vias tented up to drill 25mil, thermal gap 10mil

### Footprints (pad centres in the part's own frame; a part is rotated, then mirrored left to right if it is on the bottom)
C1206K = smd 1.5 x 2: 1 -1.5,0; 2 1.5,0
C050-050X075 = drill 0.813 octagon: 1 -2.54,0; 2 2.54,0
C0402 = smd 0.7 x 0.9: 1 -0.65,0; 2 0.65,0
C/6032-28R = smd 2.55 x 2.5: + 2.525,0; - -2.525,0
C0603K = smd 1.05 x 1.08: 1 -0.875,0; 2 0.875,0
SOD323-R = smd 0.6 x 0.6: A 1.1,0; C -1.1,0
1X02_BIG = drill 1.016 pad 1.88: P$1 0,0; P$2 3.81,0
SMD1,27-2,54 = smd 1.27 x 2.54: 1 0,0
R1206 = smd 1.6 x 1.803: 1 -1.422,0; 2 1.422,0
R0603 = smd 1 x 1.1: 1 -0.85,0; 2 0.85,0
3223J = smd 1.6 x 0.9: 1 -2,1.4; 3 -2,-1.4 | smd 1.6 x 1.3: 2 2,0
SJ = smd 1.168 x 1.6: 1 -0.762,0; 2 0.762,0
SOCKET-14 = drill 0.813 long: 1 -7.62,-3.81; 2 -5.08,-3.81; 3 -2.54,-3.81; 4 0,-3.81; 5 2.54,-3.81; 6 5.08,-3.81; 7 7.62,-3.81; 8 7.62,3.81; 9 5.08,3.81; 10 2.54,3.81; 11 0,3.81; 12 -2.54,3.81; 13 -5.08,3.81; 14 -7.62,3.81
BU-SMA-V = drill 1.5: 1 0,0 | drill 1.6: 2 -2.55,2.55; 3 2.55,2.55; 4 2.55,-2.55; 5 -2.55,-2.55
U.FL = smd 2.2 x 0.85: P$1 0,1.375; P$2 0,-1.375 | smd 1.05 x 1: P$3 1.525,0; P$4 -1.523,0
PC104-STANDARD = drill 0.9 pad 1.397 octagon: A1 6.35,10.16; A2 8.89,10.16; A3 11.43,10.16; A4 13.97,10.16; A5 16.51,10.16; A6 19.05,10.16; A7 21.59,10.16; A8 24.13,10.16; A9 26.67,10.16; A10 29.21,10.16; A11 31.75,10.16; A12 34.29,10.16; A13 36.83,10.16; A14 39.37,10.16; A15 41.91,10.16; A16 44.45,10.16; A17 46.99,10.16; A18 49.53,10.16; A19 52.07,10.16; A20 54.61,10.16; A21 57.15,10.16; A22 59.69,10.16; A23 62.23,10.16; A24 64.77,10.16; A25 67.31,10.16; A26 69.85,10.16; A27 72.39,10.16; A28 74.93,10.16; A29 77.47,10.16; A30 80.01,10.16; A31 82.55,10.16; A32 85.09,10.16; B1 6.35,12.7; B2 8.89,12.7; B3 11.43,12.7; B4 13.97,12.7; B5 16.51,12.7; B6 19.05,12.7; B7 21.59,12.7; B8 24.13,12.7; B9 26.67,12.7; B10 29.21,12.7; B11 31.75,12.7; B12 34.29,12.7; B13 36.83,12.7; B14 39.37,12.7; B15 41.91,12.7; B16 44.45,12.7; B17 46.99,12.7; B18 49.53,12.7; B19 52.07,12.7; B20 54.61,12.7; B21 57.15,12.7; B22 59.69,12.7; B23 62.23,12.7; B24 64.77,12.7; B25 67.31,12.7; B26 69.85,12.7; B27 72.39,12.7; B28 74.93,12.7; B29 77.47,12.7; B30 80.01,12.7; B31 82.55,12.7; B32 85.09,12.7; C0 26.67,7.62; C1 29.21,7.62; C2 31.75,7.62; C3 34.29,7.62; C4 36.83,7.62; C5 39.37,7.62; C6 41.91,7.62; C7 44.45,7.62; C8 46.99,7.62; C9 49.53,7.62; C10 52.07,7.62; C11 54.61,7.62; C12 57.15,7.62; C13 59.69,7.62; C14 62.23,7.62; C15 64.77,7.62; C16 67.31,7.62; C17 69.85,7.62; C18 72.39,7.62; C19 74.93,7.62; D0 26.67,5.08; D1 29.21,5.08; D2 31.75,5.08; D3 34.29,5.08; D4 36.83,5.08; D5 39.37,5.08; D6 41.91,5.08; D7 44.45,5.08; D8 46.99,5.08; D9 49.53,5.08; D10 52.07,5.08; D11 54.61,5.08; D12 57.15,5.08; D13 59.69,5.08; D14 62.23,5.08; D15 64.77,5.08; D16 67.31,5.08; D17 69.85,5.08; D18 72.39,5.08; D19 74.93,5.08 | drill 3.175 pad 6.35: GND@1 8.9,90.8; GND@2 82.5,90.8; GND@3 5.1,5.1; GND@4 85.1,5.1

### Placement (x,y rotation side)
C1  16,77.47 270 top
C2  25.15,76.96 0 top
C3  33.02,77.47 90 top
C4  52.07,81.03 180 bottom
C5  57.15,81.53 270 bottom
C6  16,59.18 270 top
C7  25.15,58.67 0 top
C8  32.77,59.18 90 top
C9  52.07,62.74 180 bottom
C10  57.15,63.25 270 bottom
C11  16,40.89 270 top
C12  25.15,40.39 0 top
C13  32.77,40.89 90 top
C14  52.07,44.45 180 bottom
C15  57.15,44.96 270 bottom
C16  16,22.61 270 top
C17  25.15,22.1 0 top
C18  32.77,22.61 90 top
C19  52.07,26.16 180 bottom
C20  57.15,26.67 270 bottom
D1  40.39,77.98 90 top
D2  43.69,77.98 270 top
D3  40.39,59.69 90 top
D4  43.69,59.69 270 top
D5  40.39,41.4 90 top
D6  43.69,41.4 270 top
D7  40.39,23.11 90 top
D8  43.69,23.11 270 top
J3  26.42,82.04 180 top
J4  26.42,63.75 180 top
J5  26.42,45.47 180 top
J6  26.42,27.18 180 top
PA1  86.87,80.77 180 top
PA2  86.87,62.48 180 top
PA3  86.87,44.2 180 top
PA4  86.87,25.91 180 top
R1  12.45,80.01 270 top
R2  17.53,81.53 180 top
R3  36.83,80.01 90 top
R4  59.44,82.04 180 bottom
R5  85.34,76.45 0 top
R6  79.25,75.18 0 top
R7  12.45,61.72 270 top
R8  17.53,63.25 180 top
R9  36.83,61.72 90 top
R10  59.44,63.75 180 bottom
R11  85.34,58.17 0 top
R12  79.25,56.9 0 top
R13  12.45,43.43 270 top
R14  17.53,44.96 180 top
R15  36.83,43.43 90 top
R16  59.44,45.47 180 bottom
R17  85.34,39.88 0 top
R18  79.25,38.61 0 top
R19  12.45,25.15 270 top
R20  17.53,26.67 180 top
R21  36.83,25.15 90 top
R22  59.44,27.18 180 bottom
R23  85.34,21.59 0 top
R24  79.25,20.32 0 top
SJ1  3.05,92.96 270 bottom
SJ2  87.63,92.96 270 bottom
SJ3  11.43,5.08 0 bottom
SJ4  79.25,5.08 180 bottom
TIM1  86.87,84.84 180 top
TIM2  86.87,66.55 180 top
TIM3  86.87,48.26 180 top
TIM4  86.87,29.97 180 top
TP1  41.91,83.82 270 top
TP2  41.91,65.53 270 top
TP3  41.91,47.24 270 top
TP4  41.91,28.96 270 top
U1  57.15,81.03 0 top
U2  57.15,62.74 0 top
U3  57.15,44.45 0 top
U4  57.15,26.16 0 top
X1  6.35,79.76 0 bottom
X2  78.99,78.23 180 bottom
X3  6.35,61.47 0 bottom
X4  78.99,59.94 180 bottom
X5  6.35,43.18 0 bottom
X6  78.99,41.66 180 bottom
X7  6.35,24.89 0 bottom
X8  78.99,23.37 180 bottom
X9  0,0 0 top

### Tracks (layer width: path | path; a pad name or v marks a point on that pad's centre or on a via)
+12V  (via drill 0.7)  (1 unrouted)
  Top 0.406: X9.B9 30.99,17.53 64.26,17.53 | v89.15,17.53 64.26,17.53 | v60.96,43.43 60.96,38.86 64.26,35.81 v89.15,35.81 | v60.96,61.72 60.96,57.4 64.26,54.1 v89.15,54.1 | v60.96,80.01 60.96,75.69 64.26,72.39 v89.15,72.39 | v60.96,25.15 60.96,20.83 64.26,17.53
  Bottom 0.305: R10.2 60.29,63.67 | R4.2 60.29,81.95 | R16.2 60.45,45.47 60.45,45.21 | R22.2 60.29,27.09
  Bottom 0.406: R4.2 60.96,81.37 v60.96,80.01 | R16.2 60.96,44.79 v60.96,43.43 | v60.96,61.72 60.96,63.08 R10.2 | v89.15,17.53 v89.15,35.81 v89.15,54.1 v89.15,72.39
A225_OUT1  (via drill 0.6)
  Top 0.406: v81.79,76.45 R5.2
  Bottom 0.406: v81.79,76.45 81.79,76.96 X2.P$3
A225_OUT2  (via drill 0.6)
  Top 0.406: R11.2 v81.79,58.17
  Bottom 0.406: v81.79,58.17 81.79,58.67 X4.P$3
A225_OUT3  (via drill 0.6)
  Top 0.406: R17.2 v81.79,39.88
  Bottom 0.406: v81.79,39.88 81.79,40.39 X6.P$3
A225_OUT4  (via drill 0.6)
  Top 0.406: R23.2 v81.79,21.59
  Bottom 0.406: v81.79,21.59 81.79,22.1 X8.P$3
APD1
  Top 0.61: C2.1 J3.P$2 19.46,82.04 R2.1
APD2
  Top 0.61: R8.1 19.46,63.75 J4.P$2 C7.1
APD3
  Top 0.61: R14.1 19.46,45.47 J5.P$2 C12.1
APD4
  Top 0.61: R20.1 19.46,27.18 J6.P$2 C17.1
GND
  Top 0.305: 40.39,79.12 D1.A | 36.88,79.11 R3.1 | D1.A 36.91,79.08 | D1.A D2.C 51.22,79.08 52.07,78.23 U1.2 | R9.1 36.91,60.79 D3.A D4.C 51.22,60.79 52.07,59.94 U2.2 | R15.1 36.91,42.5 D5.A D6.C 51.22,42.5 52.07,41.66 U3.2 | R21.1 36.91,24.21 D7.A D8.C 51.22,24.21 52.07,23.37 U4.2
  Top 0.406: R6.1 66.8,75.18 U1.7 | 36.91,79.08 R3.1 | C6.2 15.98,57.66 10.16,57.66 X3.5 | C1.2 10.14,75.97 X1.5 | R12.1 66.8,56.9 U2.7 | C11.2 10.14,39.39 X5.5 | C16.2 10.14,21.11 X7.5 | R18.1 66.8,38.61 U3.7 | R24.1 66.8,20.32 U4.7
  pour Bottom (isolate 0.305): 0,0 90.17,0 90.17,96.01 0,96.01
HV1
  Top 0.61: X1.1 10.41,79.76 11.94,78.23 12.09,78.23 R1.2
HV2
  Top 0.61: X3.1 10.41,61.47 11.94,59.94 12.09,59.94 R7.2
HV3
  Top 0.61: X5.1 10.41,43.18 11.94,41.66 12.09,41.66 R13.2
HV4
  Top 0.61: X7.1 10.41,24.89 11.94,23.37 12.09,23.37 R19.2
N$1
  Top 0.61: R1.1 15.75,81.43 R2.2 16.1,79.07 C1.1
N$2
  Top 0.61: R13.1 16,44.86 | C11.1 16,44.86 | 16,44.86 R14.2
N$3
  Top 0.406: C12.2 32.62,40.39 C13.1 40.33,40.24 D5.C D6.A 49.19,40.3 U3.1
N$4
  Top 0.406: R18.2 83.47,38.61 R17.3
N$5
  Top 0.406: C2.2 32.91,76.96 C3.1 40.23,76.82 D1.C D2.A | 43.69,76.91 D2.A | D2.A 49.19,76.88 U1.1
N$6
  Top 0.406: R6.2 83.47,75.18 R5.3
N$7
  Bottom 0.406: C5.1 U1.11 | C5.1 55.98,82.41 C4.+ | R4.1 57.52,82.04 C5.1
N$8
  Bottom 0.406: C20.1 U4.11 | R22.1 57.52,27.18 C20.1 | C20.1 55.98,27.55 C19.+
N$9
  Bottom 0.406: R16.1 57.52,45.47 C15.1 | C15.1 55.98,45.83 C14.+ | C15.1 U3.11
N$10
  Bottom 0.61: SJ4.2 85.08,5.08 X9.GND@4
N$11
  Bottom 0.406: R10.1 57.52,63.75 C10.1 | C10.1 55.98,64.12 C9.+ | C10.1 U2.11
N$12
  Bottom 0.61: SJ3.2 5.12,5.08 X9.GND@3
N$13
  Bottom 0.61: SJ2.2 84.16,92.2 X9.GND@2
N$14
  Bottom 0.61: SJ1.2 7.24,92.2 X9.GND@1
N$15
  Top 0.61: R7.1 16,63.14 | C6.1 16,63.14 | 16,63.14 R8.2
N$17
  Top 0.406: C7.2 32.62,58.67 C8.1 40.33,58.53 D3.C D4.A 49.19,58.59 U2.1
N$19
  Top 0.61: R19.1 16,26.57 | C16.1 16,26.57 | 16,26.57 R20.2
N$20
  Top 0.406: R12.2 83.47,56.9 R11.3
N$22
  Top 0.406: C17.2 32.62,22.1 C18.1 40.33,21.96 D7.C D8.A 49.19,22.01 U4.1
N$24
  Top 0.406: R24.2 83.47,20.32 R23.3
PREAMPOUT1
  Top 0.406: U1.8 67.56,84.84 70.1,82.3 79.16,82.3 R5.1 86.26,80.77 PA1.1
PREAMPOUT2
  Top 0.406: U2.8 67.56,66.55 70.1,64.01 79.25,64.01 83.6,59.66 R11.1 86.26,62.48 PA2.1
PREAMPOUT3
  Top 0.406: U3.8 67.56,48.26 70.1,45.72 79.25,45.72 83.6,41.37 R17.1 86.26,44.2 PA3.1
PREAMPOUT4  (1 unrouted)
  Top 0.406: 83.6,23.08 79.25,27.43 70.1,27.43 67.56,29.97 U4.8 | PA4.1 86.26,25.91 R23.1
TIMING1
  Top 0.406: TIM1.1 70.36,84.84 68.07,87.12 56.9,87.12 U1.12
TIMING2
  Top 0.406: TIM2.1 70.36,66.55 68.07,68.83 56.9,68.83 U2.12
TIMING3
  Top 0.406: TIM3.1 70.36,48.26 68.07,50.55 56.9,50.55 U3.12
TIMING4
  Top 0.406: TIM4.1 70.36,29.97 68.07,32.26 56.9,32.26 U4.12
TP1
  Top 0.305: C3.2 33.02,79.25 34.54,80.77 36.74,80.77 R3.2 40.73,80.86 41.91,82.04 TP1.1
TP2
  Top 0.305: C8.2 32.77,60.96 34.29,62.48 36.74,62.48 R9.2 40.73,62.57 41.91,63.75 TP2.1
TP3
  Top 0.305: C13.2 32.77,42.67 34.29,44.2 36.74,44.2 R15.2 36.92,44.2 40.64,44.2 41.91,45.47 TP3.1
TP4
  Top 0.305: TP4.1 41.91,27.18 40.64,25.91 36.92,25.91 R21.2 36.74,25.91 34.29,25.91 32.77,24.38 C18.2

### Text on the board
Document: University of Minnesota HASP / Detector Front End: Top Board | 1 | 1 | 1 | 1 | 2015 Rev 1.0